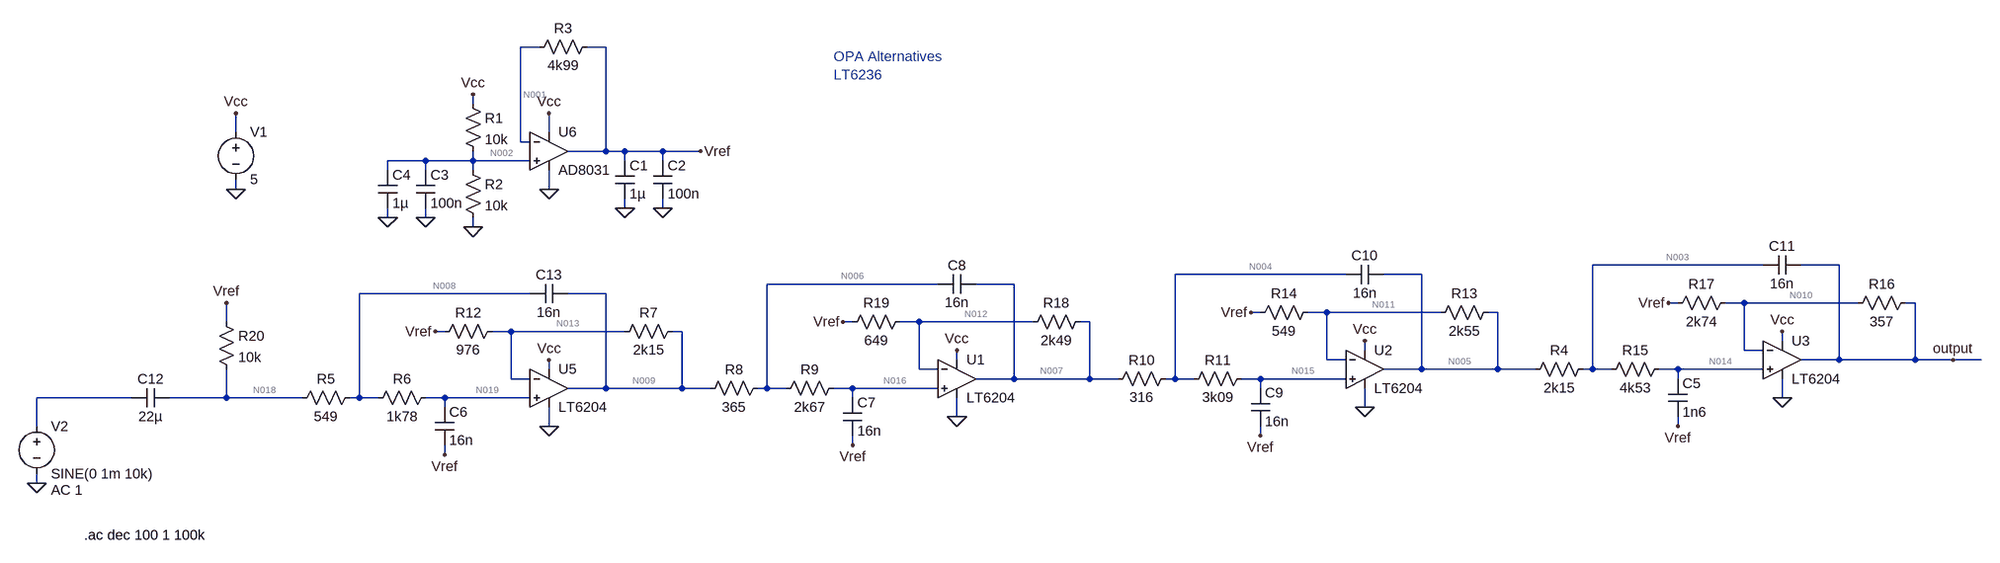
[diagram p0: schematic Input_Stage_10kHz_v2.asc]
* Input_Stage_10kHz_v2.asc
V1 Vcc 0 5
V2 N017 0 SINE(0 1m 10k) AC 1
R1 Vcc N002 10k
R2 N002 0 10k
C1 Vref 0 1µ
C2 Vref 0 100n
C3 N002 0 100n
C4 N002 0 1µ
R3 Vref N001 4k99
R8 N006 N009 365
R9 N016 N006 2k67
C7 N016 Vref 16n
C8 N007 N006 16n
XU6 N002 N001 Vcc 0 Vref AD8031  ; pins In+ In- V+ V- OUT
R18 N007 N012 2k49
R19 N012 Vref 649
R5 N008 N018 549
R6 N019 N008 1k78
C6 N019 Vref 16n
C13 N009 N008 16n
R7 N009 N013 2k15
R12 N013 Vref 976
R10 N004 N007 316
R11 N015 N004 3k09
C9 N015 Vref 16n
C10 N005 N004 16n
R13 N005 N011 2k55
R14 N011 Vref 549
R4 N003 N005 2k15
R15 N014 N003 4k53
C5 N014 Vref 1n6
C11 output N003 16n
R16 output N010 357
R17 N010 Vref 2k74
* U5: LT6204 (symbol OpAmps\LT6204 not available, pins judged from their places): In+=N019 In-=N013 V+=Vcc V-=0 OUT=N009
* U1: LT6204 (symbol OpAmps\LT6204 not available, pins judged from their places): In+=N016 In-=N012 V+=Vcc V-=0 OUT=N007
* U2: LT6204 (symbol OpAmps\LT6204 not available, pins judged from their places): In+=N015 In-=N011 V+=Vcc V-=0 OUT=N005
* U3: LT6204 (symbol OpAmps\LT6204 not available, pins judged from their places): In+=N014 In-=N010 V+=Vcc V-=0 OUT=output
C12 N018 N017 22µ
R20 Vref N018 10k
.ac dec 100 1 100k
* OPA Alternatives
* LT6236
.backanno
.end

* Results of the author's LTspice run, read from the files saved beside the schematic
* Operating Point, zero values left out:
*   V(vcc) = 5 V
*   V(n002) = 2.502 V
*   V(vref) = 2.5 V
*   V(n001) = 2.502 V
*   V(n006) = 2.557 V
*   V(n009) = 2.556 V
*   V(n016) = 2.561 V
*   V(n007) = 2.791 V
*   V(n012) = 2.561 V
*   V(n008) = 2.516 V
*   V(n018) = 2.515 V
*   V(n019) = 2.519 V
*   V(n013) = 2.519 V
*   V(n004) = 2.791 V
*   V(n015) = 2.796 V
*   V(n005) = 4.164 V
*   V(n011) = 2.795 V
*   V(n003) = 4.161 V
*   V(n014) = 4.156 V
*   V(output) = 4.372 V
*   V(n010) = 4.156 V
*   I(R1) = 249.8 µA
*   I(R2) = 250.2 µA
*   I(R3) = -449.7 nA
*   I(R8) = 1.506 µA
*   I(R9) = 1.506 µA
*   I(R18) = 92.28 µA
*   I(R19) = 93.81 µA
*   I(R5) = 1.521 µA
*   I(R6) = 1.521 µA
*   I(R7) = 17.57 µA
*   I(R12) = 19.11 µA
*   I(R10) = 1.424 µA
*   I(R11) = 1.424 µA
*   I(R13) = 536.6 µA
*   I(R14) = 538.1 µA
*   I(R4) = -1.124 µA
*   I(R15) = -1.124 µA
*   I(R16) = 605.5 µA
*   I(R17) = 604.4 µA
*   I(R20) = -1.521 µA
*   I(V1) = -12.07 mA
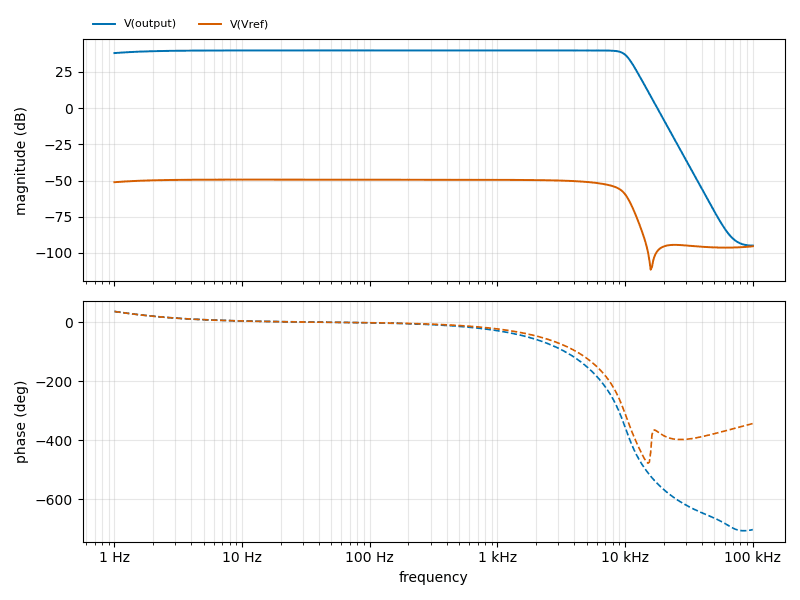
[diagram p1: AC Analysis of Input_Stage_10kHz_v2.asc, plotted from the saved traces]
* AC Analysis, 1 run:
*   V(output): 38.01 dB at 1 Hz, -94.90 dB at 100 kHz, peak 39.85 dB at 3.467 kHz, 3 dB below the peak at 10 kHz
*   V(Vref): -51.15 dB at 1 Hz, -95.39 dB at 100 kHz, peak -49.35 dB at 11.48 Hz, 3 dB below the peak at 6.73 kHz